# EAGLE design bitspinner (EAGLE 6.1)
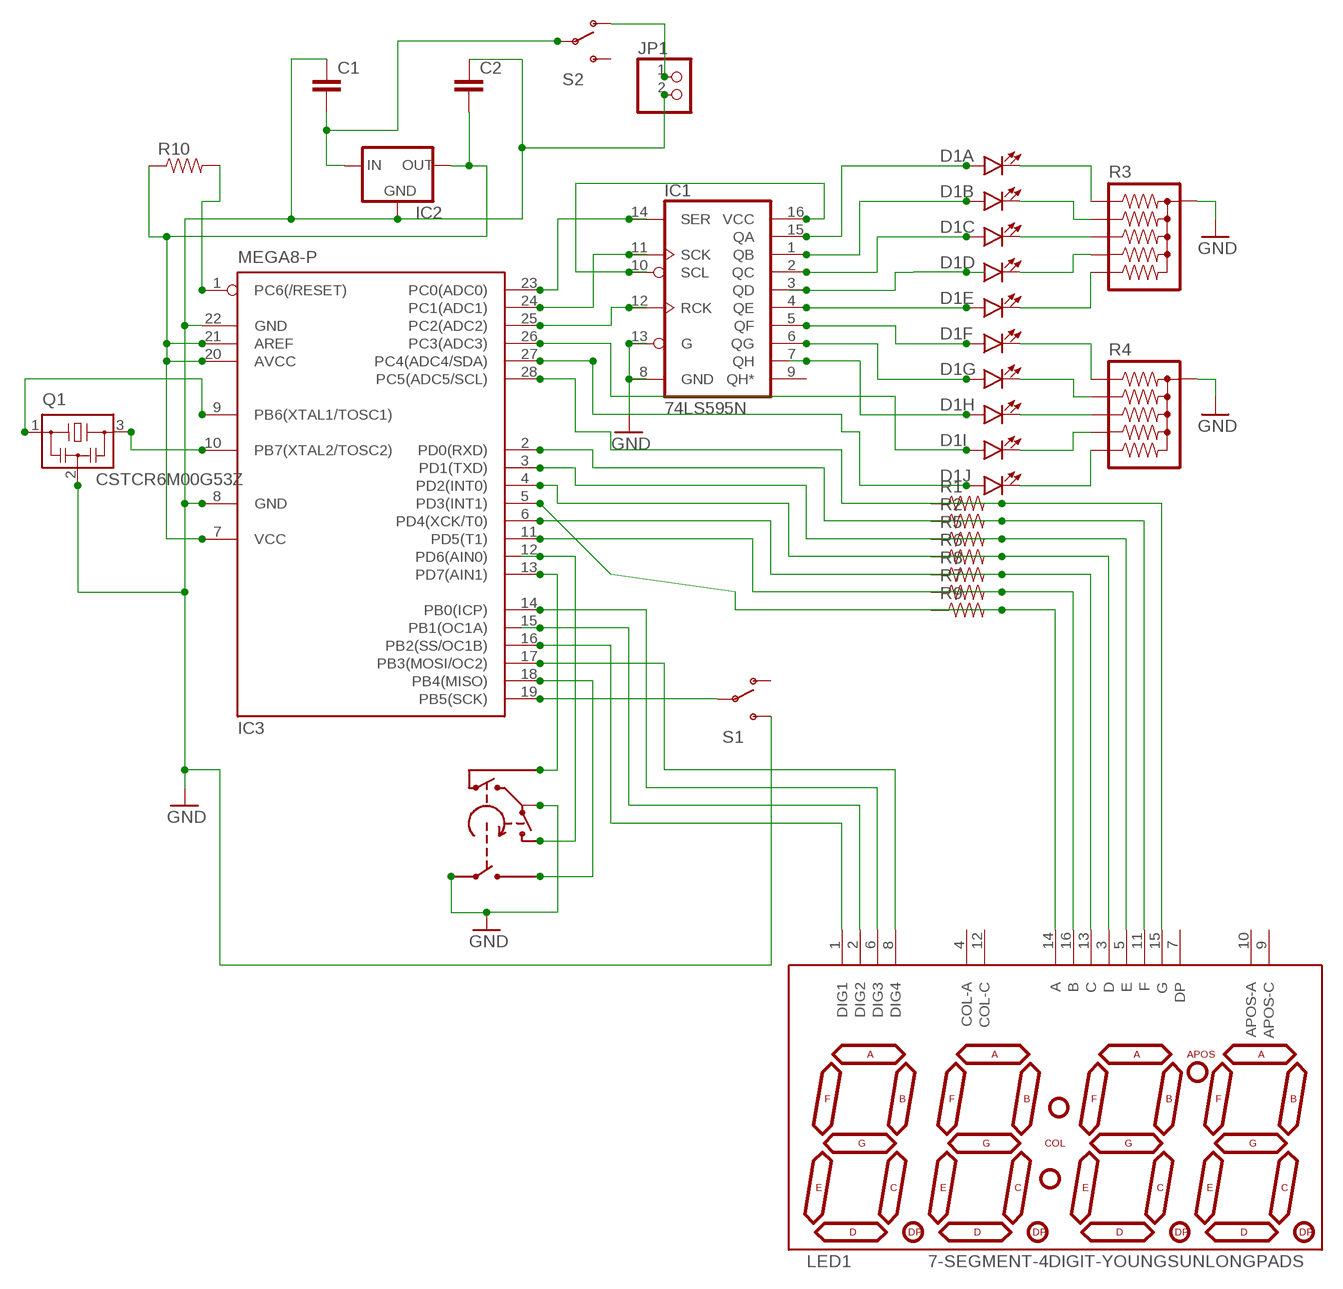
[diagram p0: schematic, sheet 1]

## Parts
C1  CAPPTH  [CAP-PTH-SMALL]
C2  CAPPTH  [CAP-PTH-SMALL]
D1  LED_BARGRAPH_10  [LED_BARGAPH_10]
IC1  74LS595N  [DIL16]
IC2  V_REG_78XXSIDE  [78XXL]
IC3  MEGA8-P  [DIL28-3]
JP1  PINHD-1X2  [1X02]
LED1  7-SEGMENT-4DIGIT-YOUNGSUNLONGPADS  [7-SEGMENT-4DIGIT-YOUNGSUN-LONGPADS]
Q1  CSTCR6M00G53Z  [CSTCR6M]
R1  RESISTORAXIAL-0.3  [AXIAL-0.3]
R2  RESISTORAXIAL-0.3  [AXIAL-0.3]
R3  RPACK-BUSSED-SIP-PTH-5  [RPACK-SIP-PTH-5]
R4  RPACK-BUSSED-SIP-PTH-5  [RPACK-SIP-PTH-5]
R5  RESISTORAXIAL-0.3  [AXIAL-0.3]
R6  RESISTORAXIAL-0.3  [AXIAL-0.3]
R7  RESISTORAXIAL-0.3  [AXIAL-0.3]
R8  RESISTORAXIAL-0.3  [AXIAL-0.3]
R9  RESISTORAXIAL-0.3  [AXIAL-0.3]
R10  RESISTORAXIAL-0.3  [AXIAL-0.3]
S1  SWITCH-SPSTPTH  [SWITCH-SPDT]
S2  SWITCH-SPSTPTH  [SWITCH-SPDT]
U$1  ALPHA-ROT-ENCODER  [TW-700198]

## Nets
GND: C1.1 C2.1 IC1.8(GND) IC1.13(G) IC2.GND IC3.8(GND) IC3.22(GND) JP1.2 Q1.2 R3.P$1 R4.P$1 S1.3(S) U$1.P2(COM) U$1.P4(S1)
N$1: D1.20(A:C) R3.P$2
N$2: D1.19(B:C) R3.P$3
N$3: D1.18(C:C) R3.P$4
N$4: D1.17(D:C) R3.P$5
N$5: D1.16(E:C) R3.P$6
N$6: D1.1(A:A) IC1.15(QA)
N$7: D1.15(F:C) R4.P$2
N$8: D1.11(J:C) R4.P$6
N$9: D1.13(H:C) R4.P$4
N$10: D1.4(D:A) IC1.3(QD)
N$11: D1.2(B:A) IC1.1(QB)
N$12: D1.3(C:A) IC1.2(QC)
N$13: IC1.10(SCL) IC1.16(VCC)
N$14: D1.5(E:A) IC1.4(QE)
N$15: IC1.14(SER) IC3.23(PC0(ADC0))
N$16: D1.14(G:C) R4.P$3
N$17: D1.12(I:C) R4.P$5
N$18: D1.6(F:A) IC1.5(QF)
N$19: D1.7(G:A) IC1.6(QG)
N$20: D1.8(H:A) IC1.7(QH)
N$21: IC1.11(SCK) IC3.24(PC1(ADC1))
N$22: IC1.12(RCK) IC3.25(PC2(ADC2))
N$23: C1.2 IC2.IN S2.2(P)
N$24: IC3.28(PC5(ADC5/SCL)) R1.P$2
N$25: IC3.2(PD0(RXD)) R2.P$2
N$26: IC3.3(PD1(TXD)) R5.P$2
N$27: LED1.14(A) R9.P$1
N$28: LED1.16(B) R7.P$1
N$29: LED1.13(C) R8.P$1
N$30: LED1.3(D) R6.P$1
N$31: LED1.5(E) R5.P$1
N$32: LED1.11(F) R2.P$1
N$33: LED1.15(G) R1.P$1
N$34: IC3.4(PD2(INT0)) R6.P$2
N$35: IC3.6(PD4(XCK/T0)) R8.P$2
N$36: IC3.11(PD5(T1)) R7.P$2
N$37: IC3.5(PD3(INT1)) R9.P$2
N$38: IC3.16(PB2(SS/OC1B)) LED1.1(DIG1)
N$39: IC3.19(PB5(SCK)) S1.2(P)
N$40: JP1.1 S2.1(O)
N$41: D1.9(I:A) IC3.26(PC3(ADC3))
N$42: D1.10(J:A) IC3.27(PC4(ADC4/SDA))
N$43: IC3.18(PB4(MISO)) U$1.P5(S2)
N$44: IC3.15(PB1(OC1A)) LED1.2(DIG2)
N$45: IC3.14(PB0(ICP)) LED1.6(DIG3)
N$46: IC3.17(PB3(MOSI/OC2)) LED1.8(DIG4)
N$47: IC3.1(PC6(/RESET)) R10.P$2
N$48: IC3.12(PD6(AIN0)) U$1.P1(B)
N$49: C2.2 IC2.OUT IC3.7(VCC) IC3.20(AVCC) IC3.21(AREF) R10.P$1
N$50: IC3.9(PB6(XTAL1/TOSC1)) Q1.1
N$52: IC3.10(PB7(XTAL2/TOSC2)) Q1.3
N$57: IC3.13(PD7(AIN1)) U$1.P3(A)
Unconnected: IC1.9(QH*) LED1.4(COL-A) LED1.7(DP) LED1.9(APOS-C) LED1.10(APOS-A) LED1.12(COL-C) S1.1(O) S2.3(S)

## Library data of the parts
C1 C2 = SparkFun:CAP: Capacitor Standard 0603 ceramic capacitor, and 0.1" leaded capacitor.
D1 = SparkFun:LED_BARGRAPH_10: 10-Segment LED Bar Graph SFE part numbers: COM-09935 (red, Vf = 2.1V, Ifmax = 20mA) COM-09936 (yellow, Vf = 2.1V, Ifmax = 20mA) COM-09937 (blue, Vf = 3.4V, Ifmax = 20mA) COM-09938 (green, Vf = 3.4V, Ifmax = 20mA)
IC1 = SparkFun:74*595: 8-bit SHIFT REGISTER, output latch
IC2 = SparkFun:V_REG_78XX: Voltage Regulator Standard 7805 5V regulator. IGO (Input Ground Output). Spark Fun Electronics SKU : COM-00107
IC3 = atmel:MEGA8-P: MICROCONTROLLER 8 Kbytes FLASH, 1 kbytes SRAM, 512 bytes EEPROM, USART, 4-channel 10 bit ADC, 2-channel 8 bit ADC Pin compatible with Atmega48, ATMega88, ATMega168 Source: avr.lbr; OC_FARNELL: unknown; OC_NEWARK: unknown
JP1 = pinhead:PINHD-1X2: PIN HEADER
LED1 = SparkFun:7-SEGMENT-4DIGIT-YOUNGSUN: This is a part for the 4-Digit 7-segment LEDs from Young Sun. Different from the Digikey LEDs, all 16 pins are used. The LONGPADS Variant is used for a test jig, but you may like it because there is more pad to solder to. If you are concerned about routing space, the standard works just fine though.
Q1 = murata-filter:CSTCR: Resonator Source: murata.co.jp; MPN: CSTCR6M00G53-R0; OC_FARNELL: 1170434; OC_NEWARK: 25M8759
R1 R2 R5-R10 = SparkFun:RESISTOR: Resistor Basic schematic elements and footprints for 0603, 1206, and PTH resistors.
R3 R4 = SparkFun:RPACK*: BOURNS 4600X series thick-film SIP resistor packs Five resistors bussed to a single pin (denoted by dot). 0.2W / resistor datasheet <http://dlnmh9ip6v2uc.cloudfront.net/datasheets/Components/General/4600x.pdf> SFE parts COM-10855 (330), COM-10856 (10K)
S1 S2 = SparkFun:SWITCH-SPST: SPST Switch Simple slide switch. Spark Fun Electronics SKU : COM-00102
U$1 = RotaryEncoder:ALPHA-ROT-ENCODER

## Net classes
0 default: width 0.203 mm

## Board
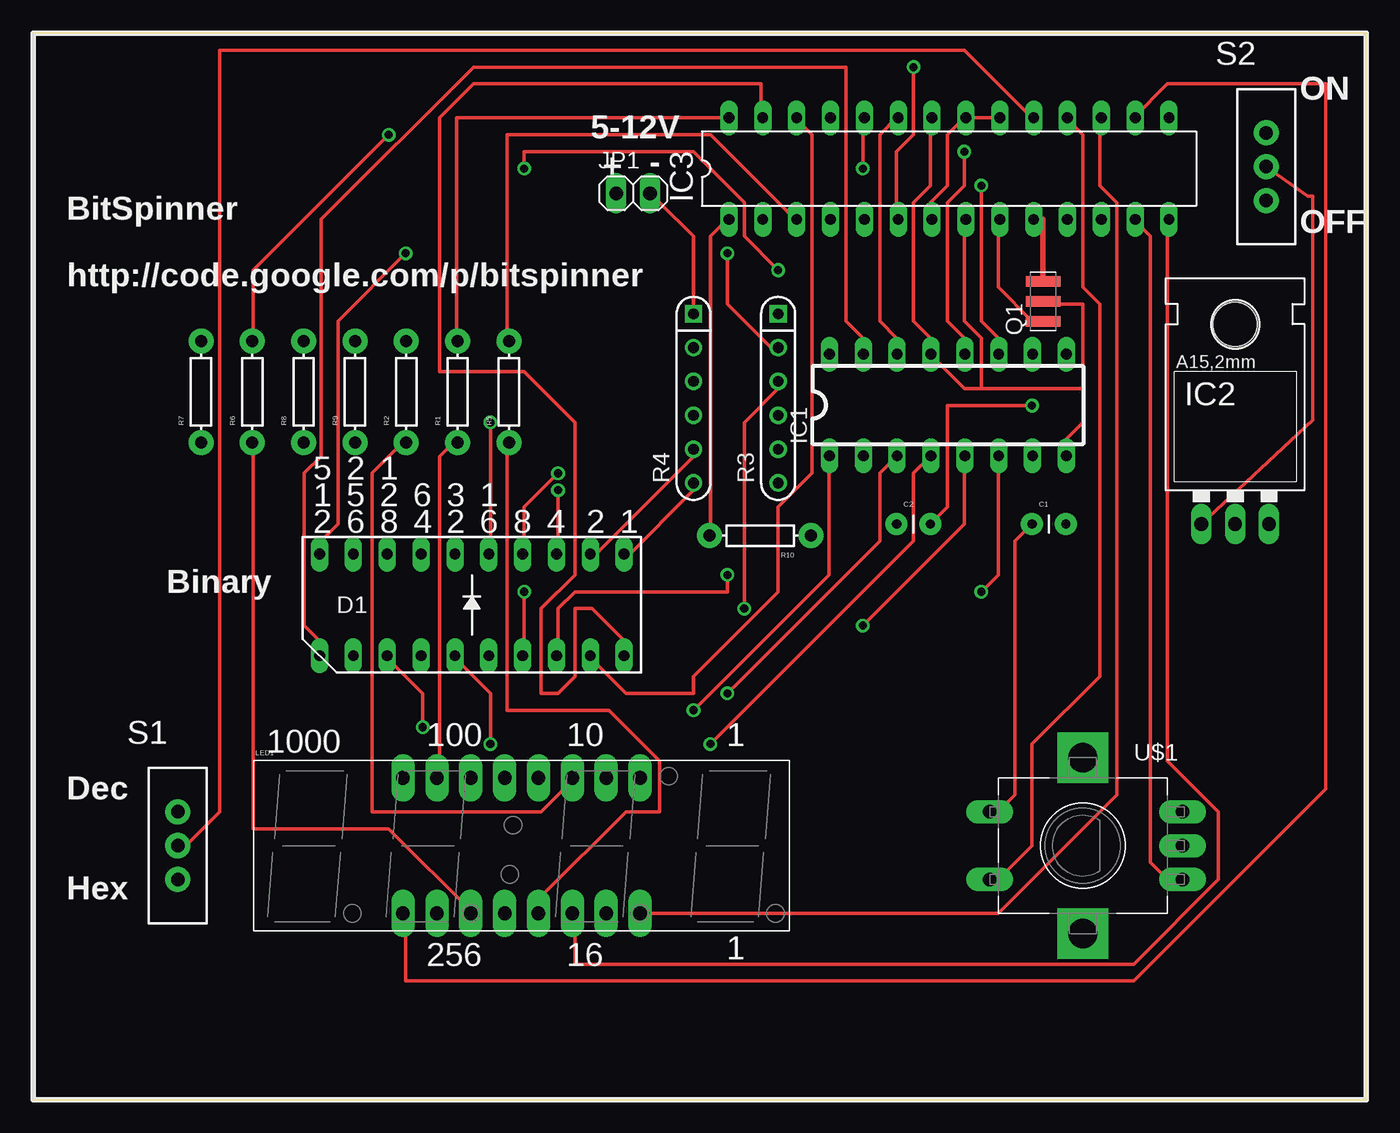
[diagram p1: board, top side]
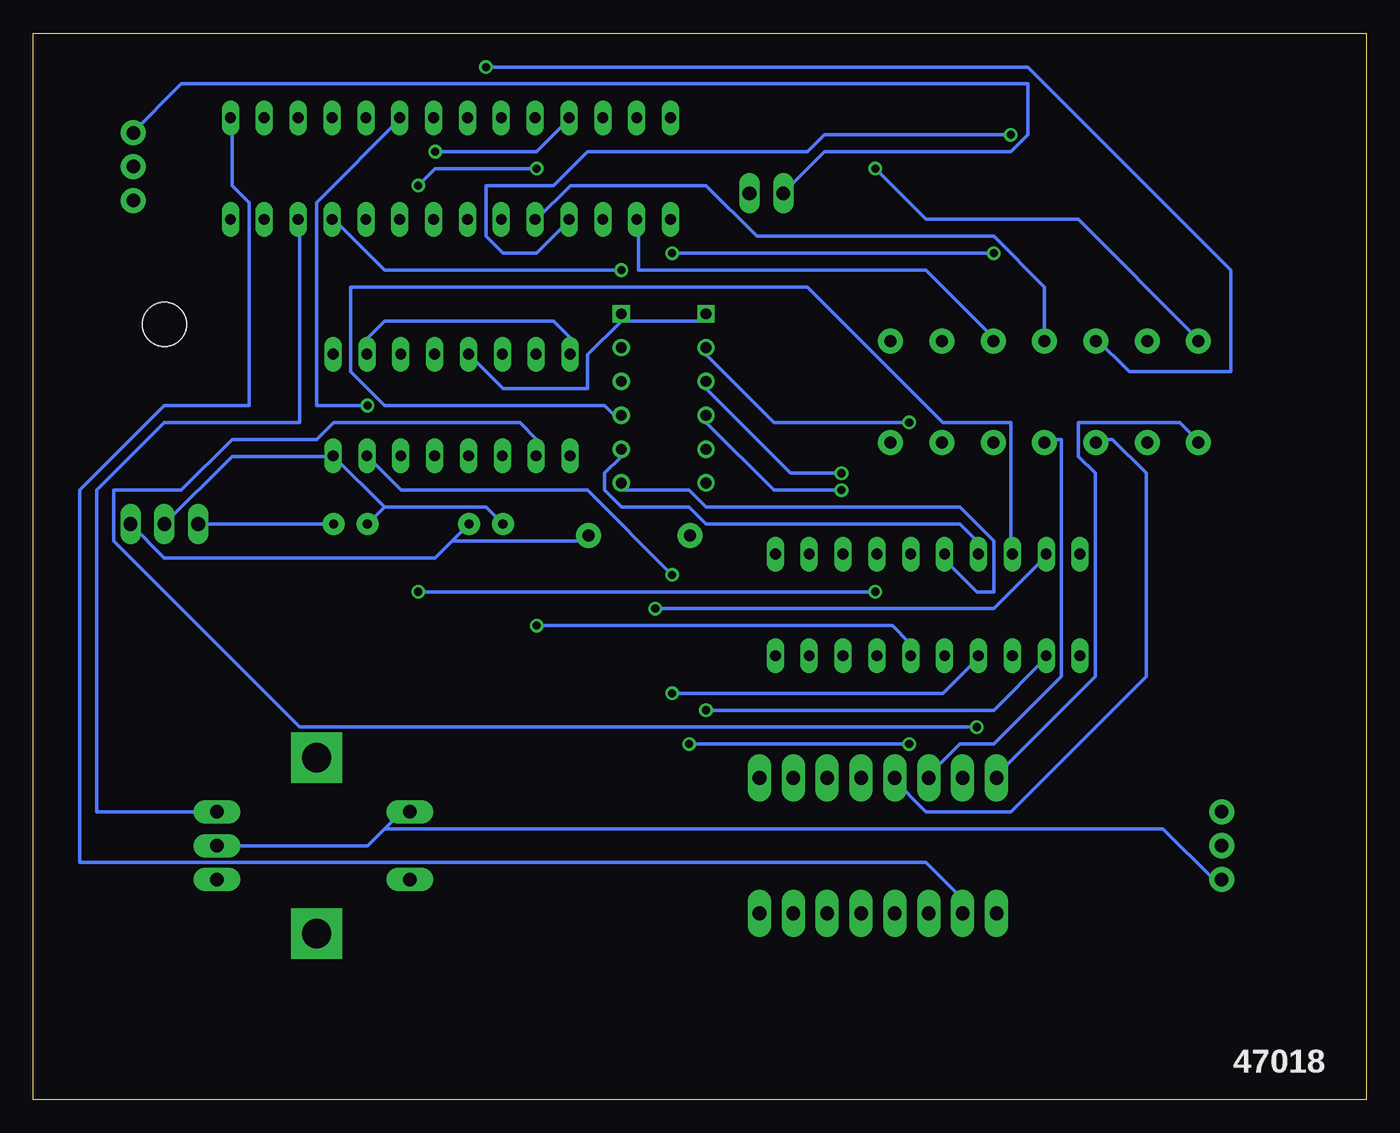
[diagram p2: board, bottom side, seen from below]

Size 100 x 80 mm. Coordinates in mm from the lower left corner, seen from the top.
Outline: 0,0 100,0 100,80 0,80 0,0
Copper layers (1*16): Top 0.035mm / dielectric 1.5mm / Bottom 0.035mm
Design rules: minimum track width 10mil, minimum drill 24mil, track to track 8mil, track to pad 8mil, pad to pad 8mil, via to via 8mil, smd to smd 8mil, copper to edge 40mil, drill to drill 8mil, minimum pad ring 10mil, minimum via ring 8mil, stop-mask expansion 4mil, vias tented up to drill 0mil, thermal gap 10mil

### Footprints (pad centres in the part's own frame; a part is rotated, then mirrored left to right if it is on the bottom)
CAP-PTH-SMALL = drill 0.7 pad 1.651: 1 0,0; 2 2.54,0
LED_BARGAPH_10 = drill 0.813 long: 1 -11.43,-3.81; 2 -8.89,-3.81; 3 -6.35,-3.81; 4 -3.81,-3.81; 5 -1.27,-3.81; 6 1.27,-3.81; 7 3.81,-3.81; 8 6.35,-3.81; 9 8.89,-3.81; 10 11.43,-3.81; 11 11.43,3.81; 12 8.89,3.81; 13 6.35,3.81; 14 3.81,3.81; 15 1.27,3.81; 16 -1.27,3.81; 17 -3.81,3.81; 18 -6.35,3.81; 19 -8.89,3.81; 20 -11.43,3.81
DIL16 = drill 0.813 long: 1 -8.89,-3.81; 2 -6.35,-3.81; 3 -3.81,-3.81; 4 -1.27,-3.81; 5 1.27,-3.81; 6 3.81,-3.81; 7 6.35,-3.81; 8 8.89,-3.81; 9 8.89,3.81; 10 6.35,3.81; 11 3.81,3.81; 12 1.27,3.81; 13 -1.27,3.81; 14 -3.81,3.81; 15 -6.35,3.81; 16 -8.89,3.81
78XXL = drill 1.016 long: GND 0,-3.81; IN -2.54,-3.81; OUT 2.54,-3.81 | hole 3.302: 0,11.176
DIL28-3 = drill 0.813 long: 1 -16.51,-3.81; 2 -13.97,-3.81; 3 -11.43,-3.81; 4 -8.89,-3.81; 5 -6.35,-3.81; 6 -3.81,-3.81; 7 -1.27,-3.81; 8 1.27,-3.81; 9 3.81,-3.81; 10 6.35,-3.81; 11 8.89,-3.81; 12 11.43,-3.81; 13 13.97,-3.81; 14 16.51,-3.81; 15 16.51,3.81; 16 13.97,3.81; 17 11.43,3.81; 18 8.89,3.81; 19 6.35,3.81; 20 3.81,3.81; 21 1.27,3.81; 22 -1.27,3.81; 23 -3.81,3.81; 24 -6.35,3.81; 25 -8.89,3.81; 26 -11.43,3.81; 27 -13.97,3.81; 28 -16.51,3.81
1X02 = drill 1.016 long: 1 -1.27,0; 2 1.27,0
7-SEGMENT-4DIGIT-YOUNGSUN-LONGPADS = drill 1.016 pad 1.778 long: 1 -8.89,-5.08; 2 -6.35,-5.08; 3 -3.81,-5.08; 4 -1.27,-5.08; 5 1.27,-5.08; 6 3.81,-5.08; 7 6.35,-5.08; 8 8.89,-5.08; 9 8.89,5.08; 10 6.35,5.08; 11 3.81,5.08; 12 1.27,5.08; 13 -1.27,5.08; 14 -3.81,5.08; 15 -6.35,5.08; 16 -8.89,5.08
CSTCR6M = smd 0.8 x 2.6: 1 -1.5,0; 2 0,0; 3 1.5,0
AXIAL-0.3 = drill 0.9 pad 1.88: P$1 -3.81,0; P$2 3.81,0
RPACK-SIP-PTH-5 = drill 0.8 square: P$1 0,0 | drill 0.8: P$2 0,-2.54; P$3 0,-5.08; P$4 0,-7.62; P$5 0,-10.16; P$6 0,-12.7
SWITCH-SPDT = drill 1.016 pad 1.88: 1 0,2.54; 2 0,0; 3 0,-2.54
TW-700198 = drill 2.2 pad 3.81 square: NC1 0,6.604; NC2 0,-6.604 | drill 1 pad 1.778 long: P1 7.493,2.54; P2 7.493,0; P3 7.493,-2.54; P4 -6.985,2.54; P5 -6.985,-2.54

### Placement (x,y rotation side)
C1  74.93,43.18 0 top
C2  64.77,43.18 0 top
D1  32.9,37.11 0 top
IC1  68.62,52.11 0 top
IC2  90.17,46.99 0 top
IC3  68.7,69.85 0 top
JP1  45,68 0 top
LED1  36.63,19.05 0 top
Q1  75.76,59.89 90 top
R1  31.83,53.1 90 top
R2  27.98,53.1 90 top
R3  55.88,58.96 0 top
R4  49.53,58.96 0 top
R5  35.68,53.1 90 top
R6  16.43,53.1 90 top
R7  12.58,53.1 90 top
R8  20.28,53.1 90 top
R9  24.13,53.1 90 top
R10  54.53,42.31 180 top
S1  10.84,19.05 0 top
S2  92.5,70 0 top
U$1  78.74,19.05 0 top

### Tracks (layer width: path | path; a pad name or v marks a point on that pad's centre or on a via)
GND
  Top 0.254: JP1.2 46.99,67.31 49.53,64.77 R4.P$1 49.53,58.42 | 78.74,53.34 78.74,50.8 77.47,49.53 IC1.8 77.47,48.26 | 78.74,53.34 78.74,59.69 76.2,59.69 Q1.2 | 78.74,53.34 71.12,53.34 | 71.12,53.34 69.85,53.34 67.31,55.88 IC1.13 67.31,57.15 66.04,58.42 66.04,67.31 67.31,68.58 67.31,73.66 IC3.22 | 71.12,53.34 71.12,57.15 69.85,58.42 69.85,66.04 IC3.8 | C1.1 73.66,41.91 73.66,22.86 72.39,21.59 U$1.P4
  Bottom 0.254: 55.88,58.42 49.53,58.42 R4.P$1 | C2.1 66.04,44.45 73.66,44.45 | C1.1 73.66,44.45 | IC2.GND 85.09,48.26 77.47,48.26 | 77.47,48.26 73.66,44.45 | 77.47,48.26 IC1.8 | 55.88,58.42 58.42,55.88 58.42,53.34 64.77,53.34 IC1.13 | 55.88,58.42 R3.P$1 | 73.66,20.32 74.93,19.05 U$1.P2 | 73.66,20.32 72.39,21.59 U$1.P4 | 73.66,20.32 15.24,20.32 11.43,16.51 S1.3
N$1  (via drill 0.61)
  Top 0.254: v52.07,63.5 52.07,59.69 55.88,55.88 R3.P$2 | v27.94,63.5 22.86,58.42 22.86,43.18 21.59,41.91 D1.20
  Bottom 0.254: v27.94,63.5 v52.07,63.5
N$2  (via drill 0.61)
  Top 0.254: v53.34,36.83 53.34,50.8 55.88,53.34 R3.P$3
  Bottom 0.254: v53.34,36.83 27.94,36.83 24.13,40.64 D1.19
N$3
  Bottom 0.254: R3.P$4 55.88,50.8 57.15,52.07 73.66,52.07 76.2,54.61 76.2,60.96 41.91,60.96 31.75,50.8 26.67,50.8 26.67,41.91 D1.18
N$4
  Bottom 0.254: R3.P$5 55.88,48.26 57.15,46.99 57.15,45.72 55.88,44.45 50.8,44.45 49.53,43.18 30.48,43.18 29.21,41.91 D1.17
N$5
  Bottom 0.254: R3.P$6 55.88,45.72 50.8,45.72 49.53,44.45 30.48,44.45 27.94,41.91 27.94,38.1 29.21,38.1 31.75,40.64 D1.16
N$6
  Top 0.254: D1.1 21.59,34.29 20.32,35.56 20.32,46.99 21.59,48.26 21.59,66.04 33.02,77.47 60.96,77.47 60.96,58.42 62.23,57.15 IC1.15
N$7  (via drill 0.61)
  Top 0.254: v34.29,50.8 34.29,41.91 D1.15
  Bottom 0.254: v34.29,50.8 44.45,50.8 49.53,55.88 R4.P$2
N$8
  Top 0.254: R4.P$6 49.53,45.72 44.45,40.64 D1.11
N$9  (via drill 0.61)
  Top 0.254: v39.37,45.72 39.37,41.91 D1.13
  Bottom 0.254: v39.37,45.72 44.45,45.72 49.53,50.8 R4.P$4
N$10  (via drill 0.61)
  Top 0.254: v52.07,30.48 63.5,41.91 63.5,46.99 IC1.3
  Bottom 0.254: v52.07,30.48 31.75,30.48 29.21,33.02 D1.4
N$11  (via drill 0.61)
  Top 0.254: v49.53,29.21 59.69,39.37 59.69,48.26 IC1.1
  Bottom 0.254: v49.53,29.21 27.94,29.21 24.13,33.02 D1.2
N$12  (via drill 0.61)
  Top 0.254: v29.21,27.94 29.21,30.48 26.67,33.02 D1.3
  Bottom 0.254: v29.21,27.94 80.01,27.94 93.98,41.91 93.98,45.72 88.9,45.72 85.09,49.53 78.74,49.53 77.47,50.8 63.5,50.8 62.23,49.53 IC1.2
N$13
  Bottom 0.254: IC1.16 59.69,57.15 60.96,58.42 73.66,58.42 74.93,57.15 IC1.10
N$14  (via drill 0.61)
  Top 0.254: v34.29,26.67 34.29,30.48 31.75,33.02 D1.5 | v50.8,26.67 66.04,41.91 66.04,46.99 IC1.4
  Bottom 0.254: v50.8,26.67 v34.29,26.67
N$15
  Top 0.254: IC1.14 64.77,57.15 63.5,58.42 63.5,72.39 64.77,73.66 IC3.23
N$16  (via drill 0.61)
  Top 0.254: v39.37,46.99 36.83,44.45 36.83,41.91 D1.14
  Bottom 0.254: v39.37,46.99 43.18,46.99 49.53,53.34 R4.P$3
N$17
  Top 0.254: R4.P$5 49.53,48.26 41.91,40.64 D1.12
N$18  (via drill 0.61)
  Top 0.254: v62.23,35.56 69.85,43.18 69.85,48.26 IC1.5
  Bottom 0.254: v62.23,35.56 35.56,35.56 34.29,34.29 D1.6
N$19  (via drill 0.61)
  Top 0.254: v36.83,38.1 36.83,34.29 D1.7 | v71.12,38.1 72.39,39.37 72.39,48.26 IC1.6
  Bottom 0.254: v71.12,38.1 v36.83,38.1
N$20  (via drill 0.61)
  Top 0.254: v52.07,39.37 52.07,38.1 40.64,38.1 39.37,36.83 39.37,34.29 D1.8
  Bottom 0.254: v52.07,39.37 58.42,45.72 72.39,45.72 IC1.7
N$21  (via drill 0.61)
  Top 0.254: v71.12,68.58 71.12,58.42 72.39,57.15 IC1.11 | v62.23,69.85 62.23,73.66 IC3.24
  Bottom 0.254: v71.12,68.58 69.85,69.85 v62.23,69.85
N$22  (via drill 0.61)
  Top 0.254: v69.85,71.12 69.85,68.58 68.58,67.31 68.58,58.42 69.85,57.15 IC1.12
  Bottom 0.254: v69.85,71.12 62.23,71.12 59.69,73.66 IC3.25
N$23
  Top 0.254: IC2.IN 96,51 96,67.77 95.63,67.77 92.71,69.85 S2.2
  Bottom 0.254: C1.2 IC2.IN
N$24
  Top 0.254: IC3.28 31.75,73.66 31.75,57.15 R1.P$2
N$25
  Bottom 0.254: IC3.2 54.61,66.04 54.61,62.23 33.02,62.23 27.94,57.15 R2.P$2
N$26
  Top 0.254: IC3.3 57.15,66.04 50.8,72.39 35.56,72.39 35.56,57.15 R5.P$2
N$27
  Bottom 0.254: LED1.14 33.02,24.13 30.48,26.67 27.94,26.67 22.86,31.75 22.86,49.53 24.13,49.53 R9.P$1
N$28
  Bottom 0.254: LED1.16 27.94,24.13 20.32,31.75 20.32,46.99 21.59,48.26 21.59,50.8 13.97,50.8 12.7,49.53 R7.P$1
N$29
  Bottom 0.254: LED1.13 35.56,24.13 33.02,21.59 26.67,21.59 16.51,31.75 16.51,46.99 19.05,49.53 20.32,49.53 R8.P$1
N$30
  Top 0.254: LED1.3 33.02,13.97 26.67,20.32 16.51,20.32 16.51,49.53 R6.P$1
N$31
  Top 0.254: LED1.5 38.1,13.97 38.1,15.24 44.45,21.59 46.99,21.59 46.99,25.4 43.18,29.21 35.56,29.21 35.56,49.53 R5.P$1
N$32
  Top 0.254: LED1.11 40.64,24.13 38.1,21.59 25.4,21.59 25.4,46.99 27.94,49.53 R2.P$1
N$33
  Top 0.254: LED1.15 30.48,24.13 30.48,48.26 31.75,49.53 R1.P$1
N$34  (via drill 0.61)
  Top 0.254: v26.67,72.39 16.51,62.23 16.51,57.15 R6.P$2
  Bottom 0.254: v26.67,72.39 40.64,72.39 41.91,71.12 58.42,71.12 60.96,68.58 66.04,68.58 66.04,64.77 64.77,63.5 62.23,63.5 59.69,66.04 IC3.4
N$35  (via drill 0.61)
  Top 0.254: v66.04,77.47 66.04,72.39 64.77,71.12 64.77,66.04 IC3.6
  Bottom 0.254: v66.04,77.47 25.4,77.47 10.16,62.23 10.16,54.61 17.78,54.61 20.32,57.15 R8.P$2
N$36  (via drill 0.61)
  Top 0.254: v55.88,62.23 53.34,64.77 53.34,67.31 49.53,71.12 36.83,71.12 v36.83,69.85
  Bottom 0.254: v55.88,62.23 73.66,62.23 77.47,66.04 IC3.11 | v36.83,69.85 33.02,66.04 21.59,66.04 12.7,57.15 R7.P$2
N$37
  Bottom 0.254: R9.P$2 24.13,60.96 27.94,64.77 45.72,64.77 49.53,68.58 59.69,68.58 62.23,66.04 IC3.5
N$38
  Top 0.254: IC3.16 82.55,73.66 85.09,76.2 96.98,76.2 96.98,23.32 82.55,8.89 27.94,8.89 27.94,13.97 LED1.1
N$39
  Top 0.254: IC3.19 74.93,73.66 69.85,78.74 13.97,78.74 13.97,21.59 11.43,19.05 S1.2
N$40
  Bottom 0.254: JP1.1 43.18,68.58 40.64,71.12 26.67,71.12 25.4,72.39 25.4,76.2 88.9,76.2 92.71,72.39 S2.1
N$41
  Top 0.254: D1.9 41.91,33.02 44.45,30.48 49.53,30.48 49.53,31.75 55.88,38.1 55.88,44.45 58.42,46.99 58.42,72.39 57.15,73.66 IC3.26
N$42
  Top 0.254: D1.10 44.45,34.29 41.91,36.83 40.64,36.83 40.64,31.75 39.37,30.48 38.1,30.48 38.1,36.83 40.64,39.37 40.64,50.8 36.83,54.61 30.48,54.61 30.48,73.66 33.02,76.2 54.61,76.2 54.61,73.66 IC3.27
N$43
  Top 0.254: IC3.18 77.47,73.66 78.74,72.39 78.74,60.96 80.01,59.69 80.01,31.75 74.93,26.67 74.93,19.05 72.39,16.51 U$1.P5
N$44
  Bottom 0.254: IC3.15 85.09,73.66 85.09,68.58 83.82,67.31 83.82,52.07 90.17,52.07 96.52,45.72 96.52,17.78 33.02,17.78 30.48,15.24 30.48,13.97 LED1.2
N$45
  Top 0.254: IC3.14 85.09,66.04 85.09,25.4 88.9,21.59 88.9,16.51 82.55,10.16 40.64,10.16 40.64,13.97 LED1.6
N$46
  Top 0.254: LED1.8 72.39,13.97 81.28,22.86 81.28,67.31 80.01,68.58 80.01,73.66 IC3.17
N$47
  Top 0.254: IC3.1 52.07,66.04 50.8,64.77 50.8,43.18 R10.P$2
N$48
  Bottom 0.254: U$1.P1 95.25,21.59 95.25,45.72 90.17,50.8 80.01,50.8 80.01,66.04 IC3.12
N$49  (via drill 0.61)
  Top 0.254: IC3.7 67.31,66.04 67.31,67.31 68.58,68.58 68.58,72.39 69.85,73.66 IC3.21 IC3.20 | v74.93,52.07 68.58,52.07 68.58,44.45 C2.2
  Bottom 0.254: IC2.OUT 90.17,40.64 69.85,40.64 68.58,41.91 | C2.2 68.58,41.91 | 68.58,41.91 58.42,41.91 R10.P$1 | v74.93,52.07 78.74,52.07 78.74,67.31 72.39,73.66 IC3.20
N$50
  Top 0.254: Q1.1 74.93,58.42 72.39,60.96 72.39,66.04 IC3.9
N$52
  Top 0.406: IC3.10 75.76,66.04 Q1.3
N$57
  Top 0.254: IC3.13 82.55,66.04 83.82,64.77 83.82,17.78 85.09,16.51 U$1.P3

### Text on the board
tPlace: ON | 5-12V | - | + | BitSpinner | OFF | http://code.google.com/p/bitspinner | 5 | 2 | 1 | 1 | 5 | 2 | 6 | 3 | 1 | 2 | 6 | 8 | 4 | 2 | 6 | 8 | 4 | 2 | 1 | Binary | 1000 | 100 | 10 | 1 | Dec | Hex | 256 | 16 | 1
bPlace: 47018